# Altium schematic sheet GPS.SchDoc: =VariantName
size 274 x 177 mm; SheetNumber: 3; SheetTotal: 7
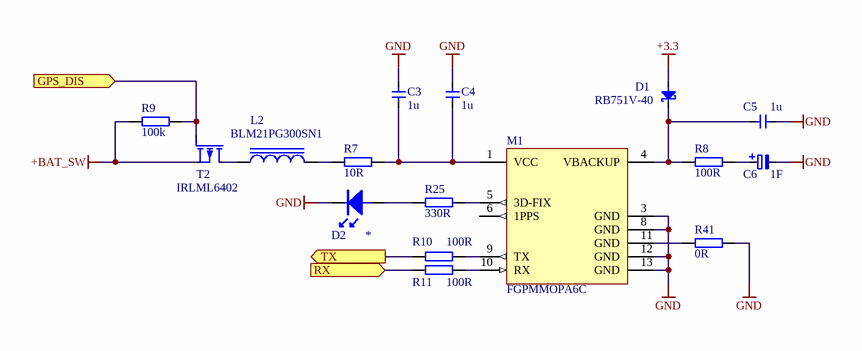
[diagram p0: GPS.SchDoc]

## Parts
C3  1u  [C0805]
C4  1u  [C0805]
C5  1u  [C0805]
C6  1F  [EECRG0V105H]
D1  RB751V-40  [SOD323]
D2  *  [LED_0805]
L2  BLM21PG300SN1  [L0805]
M1  FGPMMOPA6C  [FGPMMOPA6C]
R7  10R  [R0805]
R8  100R  [R0805]
R9  100k  [R0805]
R10  100R  [R0805]
R11  100R  [R0805]
R25  330R  [R0805]
R41  0R  [R0805]
T2  IRLML6402  [MICRO3]

## Ports
GPS_DIS (in), RX (in), TX (out)

## Nets
+3.3: D1.A
+BAT_SW: R9.2 T2.S
GND: C3.1 C4.1 C5.1 C6.- D2.K M1.3(GND) M1.8(GND) M1.12(GND) M1.13(GND) R41.1
GPS_DIS: R9.1 T2.G ; port GPS_DIS
RX: R11.2 ; port RX
TX: R10.2 ; port TX
NetC3_2: C3.2 C4.2 M1.1(VCC) R7.1
NetC5_2: C5.2 D1.K M1.4(VBACKUP) R8.2
NetC6_+: C6.+ R8.1
NetD2_A: D2.A R25.2
NetL2_1: L2.1 T2.D
NetL2_2: L2.2 R7.2
NetM1_5: M1.5(3D-FIX) R25.1
NetM1_9: M1.9(TX) R10.1
NetM1_10: M1.10(RX) R11.1
NetM1_11: M1.11(GND) R41.2

Not connected (* = marked no-connect by the designer): M1 6(1PPS)

## Notes on the sheet
- Name:
- Device:
- File:

## Library data of the parts
C3-C5 = C: C; capacitor; Value: 1u; P&P: *
C6 = C_pol: C; Polarized Capacitor; Indeks: MKOT0005213; P&P: 0; Value: 1F
D1 = RB751V-40: DS; Schottky Rectifier; Indeks: MDISS002; P&P: 1; Value: RB751V-40
D2 = LED: LED;; Indeks: *; Value: *; P&P: *
L2 = BLM21PG300SN1: L;; Indeks: MIDSD062; P&P: 1; Value: BLM21PG300SN1
M1 = FGPMMOPA6C: GPS; Indeks: MUKSC480; P&P: 1; Value: FGPMMOPA6C
R7-R11 R25 R41 = R: R; resistor; Indeks: *; P&P: *
  R7: Value: 10R
  R8 R10 R11: Value: 100R
  R9: Value: 100k
  R25: Value: 330R
  R41: Value: 0R
T2 = IRLML6402: T_M_P; P-Channel MOSFET; Indeks: MTRSP030; P&P: 1; Value: IRLML6402